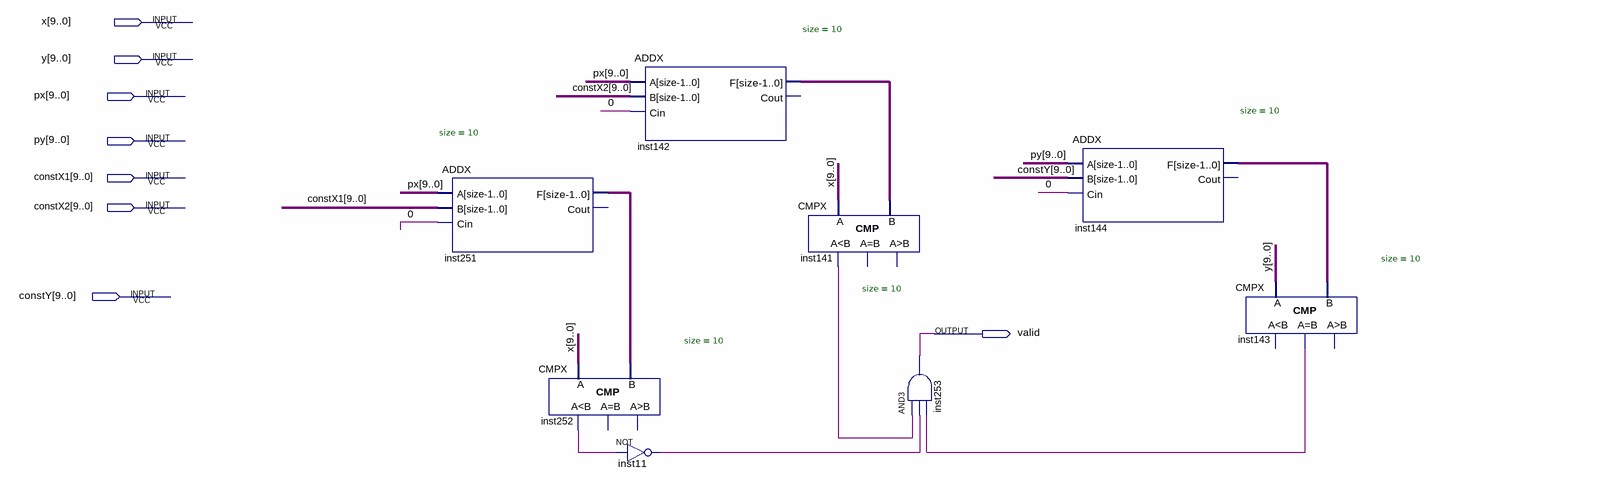
[diagram p0: schematic sheet]
// Quartus schematic duzHoriz.bdf as structural Verilog: 8 symbols, 8 pins
module duzHoriz (
  input  [9:0] x,
  input  [9:0] y,
  input  [9:0] px,
  input  [9:0] py,
  input  [9:0] constX1,
  input  [9:0] constX2,
  input  [9:0] constY,
  output valid
);

  wire \0 , inst11_out, inst141_ls, inst143_eq, inst252_ls;
  wire [9:0] inst142_f, inst144_f, inst251_f;

  ADDX #(.size(10)) inst251 (.A(px), .B(constX1), .Cin(\0 ), .F(inst251_f));  // open: Cout
  CMPX #(.size(10)) inst252 (.A(x), .B(inst251_f), .ls(inst252_ls));  // open: eq, gr
  ADDX #(.size(10)) inst142 (.A(px), .B(constX2), .Cin(\0 ), .F(inst142_f));  // open: Cout
  not inst11 (inst11_out, inst252_ls);
  CMPX #(.size(10)) inst141 (.A(x), .B(inst142_f), .ls(inst141_ls));  // open: eq, gr
  and inst253 (valid, inst141_ls, inst11_out, inst143_eq);
  ADDX #(.size(10)) inst144 (.A(py), .B(constY), .Cin(\0 ), .F(inst144_f));  // open: Cout
  CMPX #(.size(10)) inst143 (.A(y), .B(inst144_f), .eq(inst143_eq));  // open: ls, gr
endmodule
